# Altium schematic sheet ESP32.SchDoc
size A4
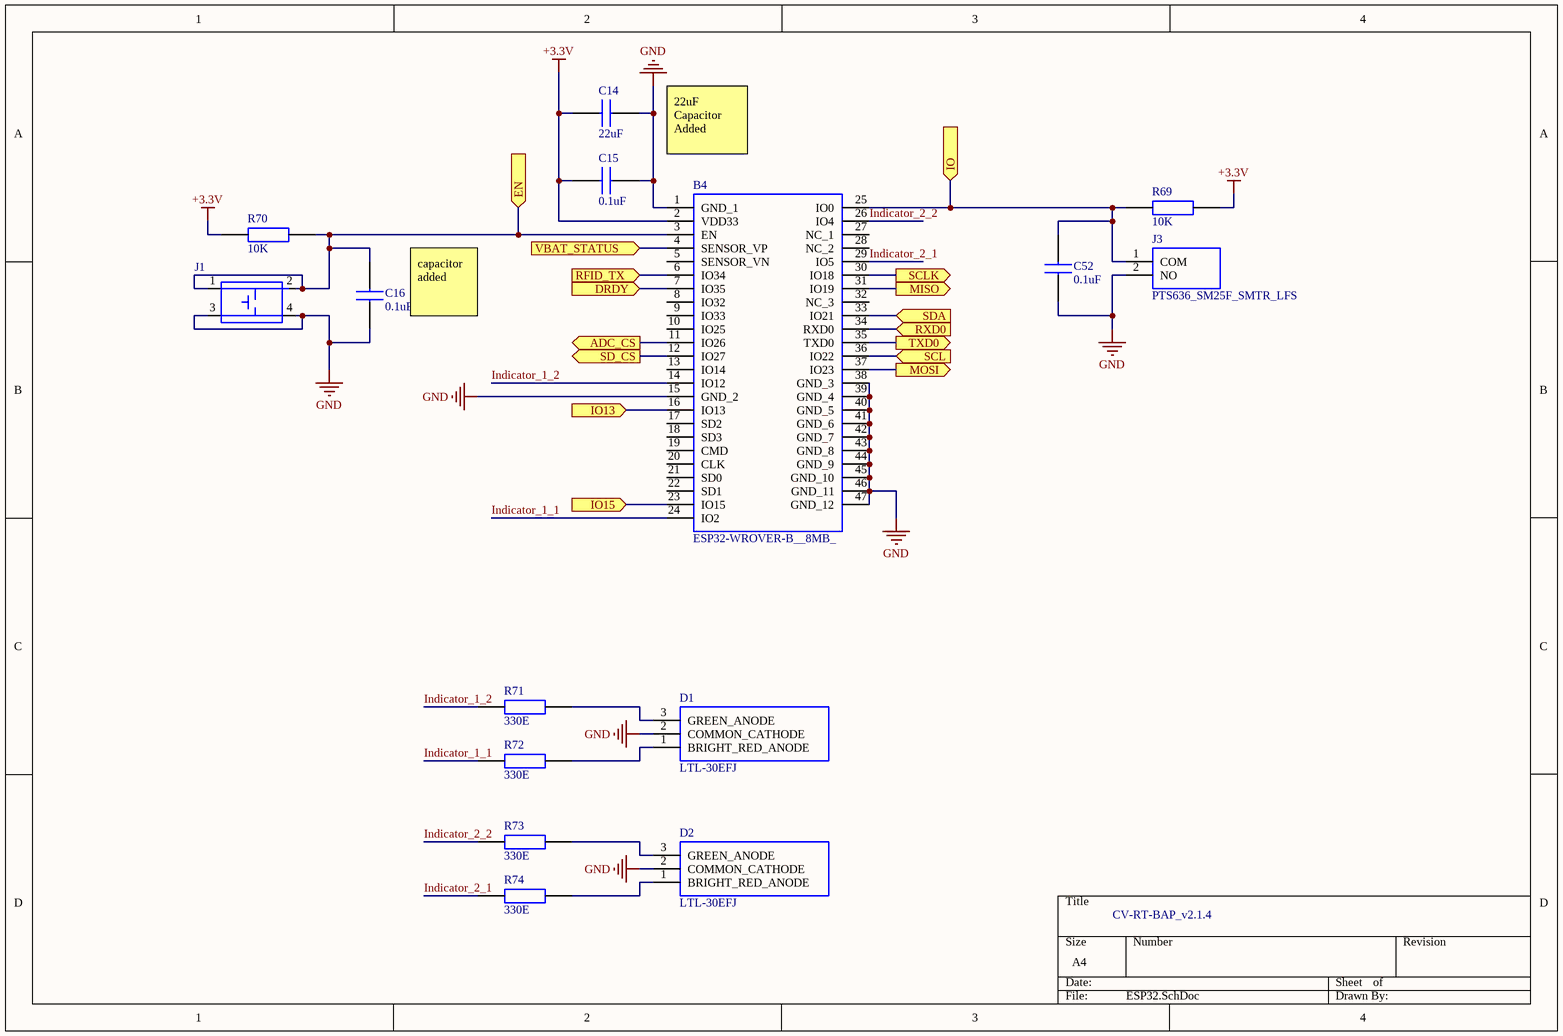
[diagram p0: ESP32.SchDoc]

## Parts
B4  ESP32-WROVER-B__8MB_  [ESP32WROVERB8MB]
C14  22uF  [CAPC3216X180N]
C15  0.1uF  [CAPC1005X55N]
C16  0.1uF  [CAPC1005X55N]
C52  0.1uF  [CAPC1005X55N]
D1  LTL-30EFJ  [LTL-30EHJ]
D2  LTL-30EFJ  [LTL-30EHJ]
J1  Tactile switch_TH  [Tactile switch_vertical]  (value not drawn)
J3  PTS636_SM25F_SMTR_LFS  [PTS636SM25FSMTRLFS]
R69  10K  [RESC1005X40N]
R70  10K  [RESC1005X40N]
R71  330E  [RESC1005X40N]
R72  330E  [RESC1005X40N]
R73  330E  [RESC1005X40N]
R74  330E  [RESC1005X40N]

## Ports
ADC_CS (out), DRDY (in), EN (in), IO13 (in), IO15 (in), IO (in), MISO (out), MOSI (out), RFID_TX (in), RXD0 (in), SCL (in), SCLK (out), SD_CS (out), SDA (in), TXD0 (out), VBAT_STATUS (in)

## Nets
+3.3V: B4.2(VDD33) C14.1 C15.1 R69.2 R70.1
GND: B4.1(GND_1) B4.15(GND_2) B4.38(GND_3) B4.39(GND_4) B4.40(GND_5) B4.41(GND_6) B4.42(GND_7) B4.43(GND_8) B4.44(GND_9) B4.45(GND_10) B4.46(GND_11) B4.47(GND_12) C14.2 C15.2 C16.1 C52.1 D1.2(COMMON_CATHODE) D2.2(COMMON_CATHODE) J1.3 J1.4 J3.2(NO)
ADC_CS: B4.11(IO26) ; port ADC_CS
DRDY: B4.7(IO35) ; port DRDY
EN: B4.3(EN) C16.2 J1.1 J1.2 R70.2 ; port EN
Indicator_1_1: B4.24(IO2) R72.1
Indicator_1_2: B4.14(IO12) R71.1
Indicator_2_1: B4.29(IO5) R74.1
Indicator_2_2: B4.26(IO4) R73.1
IO: B4.25(IO0) C52.2 J3.1(COM) R69.1 ; port IO
IO13: B4.16(IO13) ; port IO13
IO15: B4.23(IO15) ; port IO15
MISO: B4.31(IO19) ; port MISO
MOSI: B4.37(IO23) ; port MOSI
RFID_TX: B4.6(IO34) ; port RFID_TX
RXD0: B4.34(RXD0) ; port RXD0
SCL: B4.36(IO22) ; port SCL
SCLK: B4.30(IO18) ; port SCLK
SD_CS: B4.12(IO27) ; port SD_CS
SDA: B4.33(IO21) ; port SDA
TXD0: B4.35(TXD0) ; port TXD0
VBAT_STATUS: B4.4(SENSOR_VP) ; port VBAT_STATUS
NetD1_1: D1.1(BRIGHT_RED_ANODE) R72.2
NetD1_3: D1.3(GREEN_ANODE) R71.2
NetD2_1: D2.1(BRIGHT_RED_ANODE) R74.2
NetD2_3: D2.3(GREEN_ANODE) R73.2

Not connected (* = marked no-connect by the designer): B4 5(SENSOR_VN) 8(IO32) 9(IO33) 10(IO25) 13(IO14) 17(SD2) 18(SD3) 19(CMD) 20(CLK) 21(SD0) 22(SD1) 27(NC_1) 28(NC_2) 32(NC_3)

## Notes on the sheet
- 22uF Capacitor Added
- (near C16) capacitor added
- CV-RT-BAP_v2.1.4

## Library data of the parts
B4 = ESP32-WROVER-B__8MB_: WiFi Modules (802.11) SMD Module M213DH6464PH3Q0, ESP32-D0WD, 64Mbits PSRAM, 8MB SPI flash, PCB Antenna; Manufacturer_Name: Espressif; Manufacturer_Part_Number: ESP32-WROVER-B (8MB); Geometry.Height: 3.4mm; Arrow Part Number: ESP32-WROVER-B (8MB); Arrow Price/Stock: *; Mouser Part Number: 356-ESP32-WRO-B(8MB); Mouser Price/Stock: *; Datasheet Link: https://eu.mouser.com/datasheet/2/891/esp32-wrover-b_datasheet_en-1384674.pdf
C14 = C0402C104M4RECTU: Multilayer Ceramic Capacitors MLCC - SMD/SMT 25V 22uF X7R 0402 20%; Manufacturer_Name: Kemet; Geometry.Height: 0.55mm; Manufacturer_Part_Number: C0402C104M4RECTU; Arrow Part Number: C0402C104M4RECTU; Arrow Price/Stock: *; Mouser Part Number: 80-C0402C104M4RECTU; Mouser Price/Stock: https://www.mouser.com/Search/Refine.aspx?Keyword=80-C0402C104M4RECTU; Datasheet Link: https://content.kemet.com/datasheets/KEM_C1002_X7R_SMD.pdf
C15 C16 C52 = C0402C104M4RECTU: Multilayer Ceramic Capacitors MLCC - SMD/SMT 16V 0.1uF X7R 0402 20%; Manufacturer_Name: Kemet; Geometry.Height: 0.55mm; Manufacturer_Part_Number: C0402C104M4RECTU; Arrow Part Number: C0402C104M4RECTU; Arrow Price/Stock: *; Mouser Part Number: 80-C0402C104M4RECTU; Mouser Price/Stock: https://www.mouser.com/Search/Refine.aspx?Keyword=80-C0402C104M4RECTU; Datasheet Link: https://content.kemet.com/datasheets/KEM_C1002_X7R_SMD.pdf
D1 D2 = LTL-30EFJ: Standard LEDs - Through Hole Red/Green Diffused; Manufacturer_Name: Lite-On; Manufacturer_Part_Number: LTL-30EFJ; Arrow Part Number: LTL-30EFJ; Arrow Price/Stock: https://www.arrow.com/en/products/ltl-30efj/lite-on-technology; Mouser Part Number: 859-LTL-30EFJ; Mouser Price/Stock: https://www.mouser.com/Search/Refine.aspx?Keyword=859-LTL-30EFJ; Datasheet Link: https://componentsearchengine.com/Datasheets/1/LTL-30EFJ.pdf
J1 = Tactile switch_TH: Part Number: SKHHANA010
J3 = PTS636_SM25F_SMTR_LFS: Tactile Switches Tact 50mA 12VDC, 6.0x3.5, 2.5mm H, 180gf, F leads, No ground pin, White Actuator; Manufacturer_Name: C & K COMPONENTS; Manufacturer_Part_Number: PTS636 SM25F SMTR LFS; Geometry.Height: 2.7mm; Arrow Part Number: PTS636 SM25F SMTR LFS; Arrow Price/Stock: https://www.arrow.com/en/products/pts636-sm25f-smtr-lfs/ck; Mouser Part Number: 611-PTS636SM25FSMTRL; Mouser Price/Stock: https://www.mouser.co.uk/ProductDetail/CK/PTS636-SM25F-SMTR-LFS?qs=vLWxofP3U2wcBTQSwfMFOw%3D%3D; Datasheet Link: https://ms.componentsearchengine.com/Datasheets/1/PTS636 SM25F SMTR LFS.pdf
R69 R70 = CRCW040210K0FKED: CRCW0402 Resistor T/R 0.063W,1%,10K Vishay CRCW Series Thick Film Surface Mount Resistor 0402 Case 10k +/-1% 0.063W +/-100ppm/C; Geometry.Height: 0.4mm; Manufacturer_Name: Vishay; Manufacturer_Part_Number: CRCW040210K0FKED; Arrow Part Number: CRCW040210K0FKED; Arrow Price/Stock: https://www.arrow.com/en/products/crcw040210k0fked/vishay; Mouser Part Number: 71-CRCW0402-10K-E3; Mouser Price/Stock: https://www.mouser.co.uk/ProductDetail/Vishay-Dale/CRCW040210K0FKED?qs=rlE3Te1NifyN3e8vvxacSw%3D%3D; Datasheet Link: http://www.vishay.com/docs/20035/dcrcwe3.pdf
R71-R74 = RC0402FR-07330RL: YAGEO (PHYCOMP) - RC0402FR-07330RL - RES, THICK FILM, 330R, 1%, 0.063W, 0402; Geometry.Height: 0.4mm; Manufacturer_Name: YAGEO (PHYCOMP); Manufacturer_Part_Number: RC0402FR-07330RL; Arrow Part Number: RC0402FR-07330RL; Arrow Price/Stock: https://www.arrow.com/en/products/rc0402fr-07330rl/yageo; Mouser Part Number: 603-RC0402FR-07330RL; Mouser Price/Stock: https://www.mouser.com/Search/Refine.aspx?Keyword=603-RC0402FR-07330RL; Datasheet Link: http://www.yageo.com/documents/recent/PYu-RC0402_51_RoHS_L_6_r.pdf